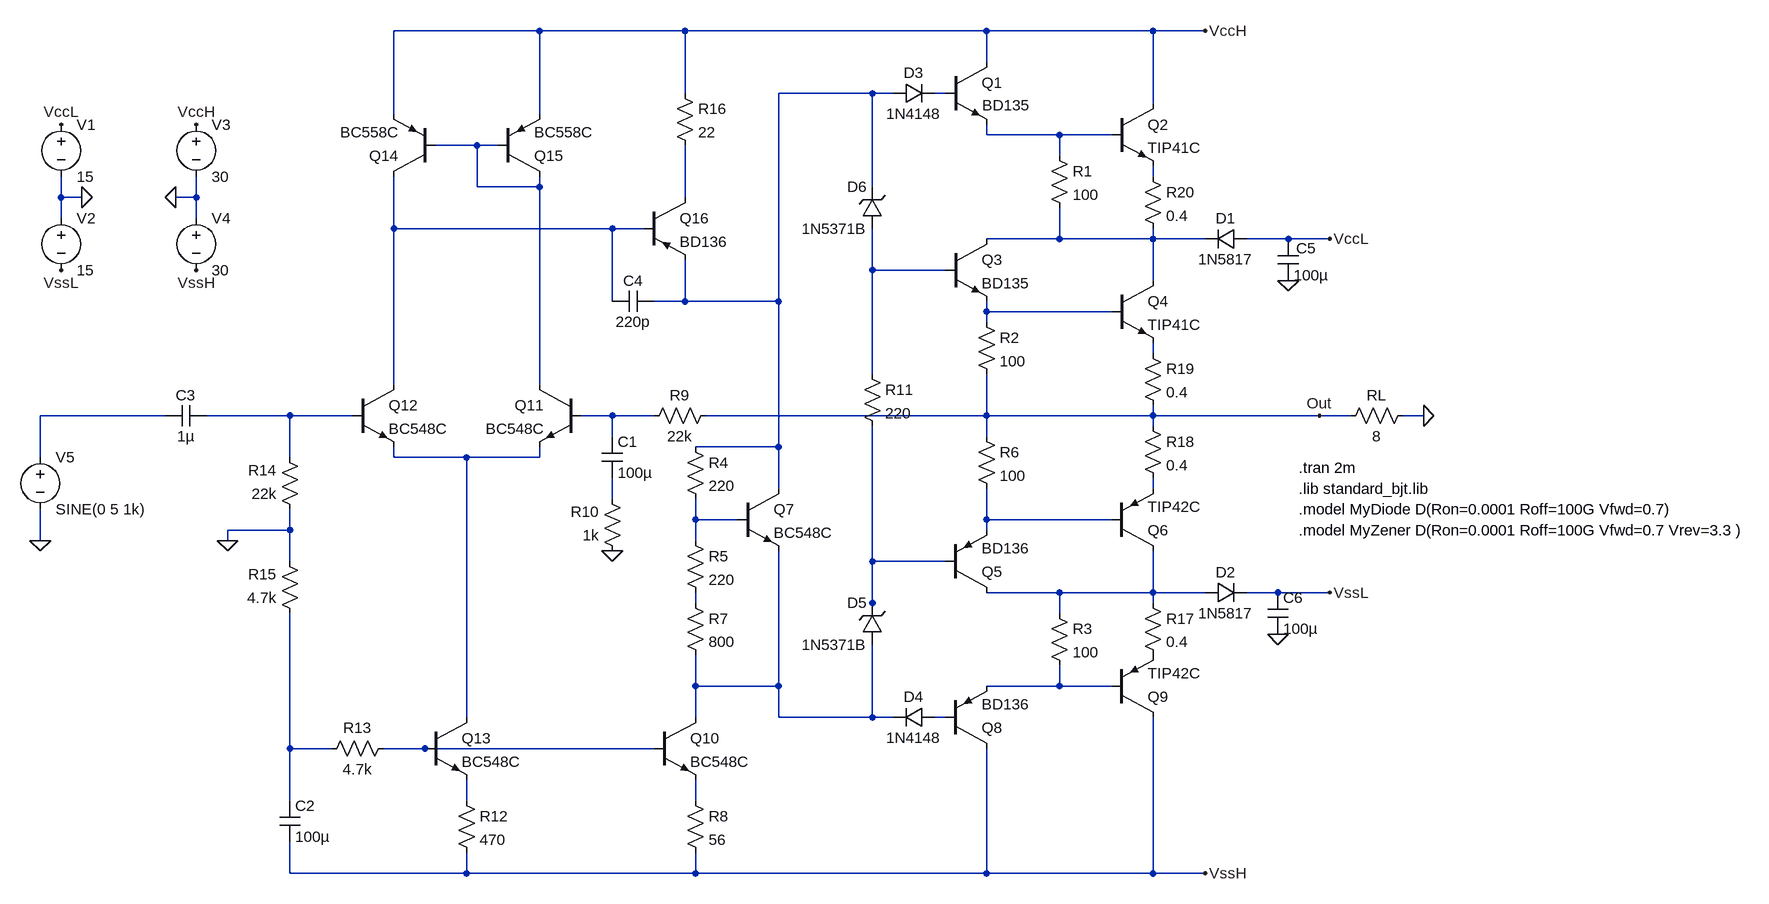
[diagram p0: schematic etapa_clase_G.asc]
etapa_clase_G.asc, the LTspice schematic file:
Version 4
SHEET 1 1736 1404
WIRE -512 48 -736 48
WIRE -288 48 -512 48
WIRE 176 48 -288 48
WIRE 432 48 176 48
WIRE 512 48 432 48
WIRE 176 96 176 48
WIRE -288 144 -288 48
WIRE 0 144 -144 144
WIRE 32 144 0 144
WIRE 112 144 96 144
WIRE 432 160 432 48
WIRE -736 176 -736 48
WIRE -512 176 -512 48
WIRE 176 208 176 192
WIRE 288 208 176 208
WIRE 368 208 288 208
WIRE -608 224 -672 224
WIRE -576 224 -608 224
WIRE 288 240 288 208
WIRE 432 272 432 256
WIRE -608 288 -608 224
WIRE -512 288 -512 272
WIRE -512 288 -608 288
WIRE 0 288 0 144
WIRE -1248 304 -1248 272
WIRE -1216 304 -1248 304
WIRE -1040 304 -1040 272
WIRE -1040 304 -1072 304
WIRE -288 304 -288 224
WIRE -1248 336 -1248 304
WIRE -1040 336 -1040 304
WIRE -736 352 -736 272
WIRE -400 352 -736 352
WIRE -352 352 -400 352
WIRE 288 368 288 320
WIRE 288 368 176 368
WIRE 432 368 432 352
WIRE 432 368 288 368
WIRE 512 368 432 368
WIRE 640 368 576 368
WIRE 704 368 640 368
WIRE 0 416 0 352
WIRE 112 416 0 416
WIRE 432 432 432 368
WIRE -400 464 -400 352
WIRE -288 464 -288 400
WIRE -288 464 -336 464
WIRE -144 464 -144 144
WIRE -144 464 -288 464
WIRE 176 480 176 464
WIRE 368 480 176 480
WIRE 176 496 176 480
WIRE 432 544 432 528
WIRE 0 576 0 416
WIRE -736 592 -736 352
WIRE -512 592 -512 288
WIRE -1088 640 -1280 640
WIRE -896 640 -1024 640
WIRE -800 640 -896 640
WIRE -400 640 -448 640
WIRE -336 640 -400 640
WIRE 176 640 176 576
WIRE 176 640 -256 640
WIRE 432 640 432 624
WIRE 432 640 176 640
WIRE 688 640 432 640
WIRE 736 640 688 640
WIRE 848 640 816 640
WIRE 432 656 432 640
WIRE -400 672 -400 640
WIRE 176 672 176 640
WIRE -144 688 -144 464
WIRE -144 688 -272 688
WIRE -1280 704 -1280 640
WIRE -896 704 -896 640
WIRE -736 704 -736 688
WIRE -624 704 -736 704
WIRE -512 704 -512 688
WIRE -512 704 -624 704
WIRE -144 752 -144 688
WIRE 432 752 432 736
WIRE -400 768 -400 736
WIRE -272 800 -272 768
WIRE -208 800 -272 800
WIRE 176 800 176 752
WIRE 368 800 176 800
WIRE -896 816 -896 784
WIRE -896 816 -992 816
WIRE 176 816 176 800
WIRE -1280 832 -1280 784
WIRE -992 832 -992 816
WIRE -272 832 -272 800
WIRE -896 864 -896 816
WIRE 0 864 0 656
WIRE 112 864 0 864
WIRE 288 912 176 912
WIRE 432 912 432 848
WIRE 432 912 288 912
WIRE 512 912 432 912
WIRE 624 912 576 912
WIRE 704 912 624 912
WIRE -272 928 -272 912
WIRE 0 928 0 864
WIRE 432 928 432 912
WIRE 0 944 0 928
WIRE 288 944 288 912
WIRE -272 1056 -272 1008
WIRE -144 1056 -144 848
WIRE -144 1056 -272 1056
WIRE 288 1056 288 1024
WIRE 288 1056 176 1056
WIRE 368 1056 288 1056
WIRE -624 1104 -624 704
WIRE -272 1104 -272 1056
WIRE -144 1104 -144 1056
WIRE 0 1104 0 992
WIRE 0 1104 -144 1104
WIRE 32 1104 0 1104
WIRE 112 1104 96 1104
WIRE -896 1152 -896 944
WIRE -832 1152 -896 1152
WIRE -688 1152 -752 1152
WIRE -336 1152 -688 1152
WIRE -896 1232 -896 1152
WIRE -624 1232 -624 1200
WIRE -272 1232 -272 1200
WIRE -896 1344 -896 1296
WIRE -624 1344 -624 1312
WIRE -624 1344 -896 1344
WIRE -272 1344 -272 1312
WIRE -272 1344 -624 1344
WIRE 176 1344 176 1152
WIRE 176 1344 -272 1344
WIRE 432 1344 432 1104
WIRE 432 1344 176 1344
WIRE 512 1344 432 1344
FLAG 704 368 VccL
FLAG 512 48 VccH
FLAG 848 640 0
FLAG 512 1344 VssH
FLAG 704 912 VssL
FLAG -1216 304 0
FLAG -1072 304 0
FLAG -1040 192 VccH
FLAG -1248 192 VccL
FLAG -1040 416 VssH
FLAG -1248 416 VssL
FLAG 688 640 Out
FLAG -400 848 0
FLAG -992 832 0
FLAG -1280 832 0
FLAG 640 432 0
FLAG 624 976 0
SYMBOL npn 112 96 R0
WINDOW 3 57 66 Left 2
SYMATTR Value BD135
SYMATTR InstName Q1
SYMBOL npn 368 160 R0
SYMATTR InstName Q2
SYMATTR Value TIP41C
SYMBOL npn 112 368 R0
SYMATTR InstName Q3
SYMATTR Value BD135
SYMBOL npn 368 432 R0
SYMATTR InstName Q4
SYMATTR Value TIP41C
SYMBOL res 272 224 R0
SYMATTR InstName R1
SYMATTR Value 100
SYMBOL res 720 656 R270
WINDOW 0 32 56 VTop 2
WINDOW 3 0 56 VBottom 2
SYMATTR InstName RL
SYMATTR Value 8
SYMBOL pnp 112 912 M180
SYMATTR InstName Q5
SYMATTR Value BD136
SYMBOL pnp 368 848 M180
SYMATTR InstName Q6
SYMATTR Value TIP42C
SYMBOL diode 512 928 R270
WINDOW 0 32 32 VTop 2
WINDOW 3 0 32 VBottom 2
SYMATTR InstName D2
SYMATTR Value 1N5817
SYMBOL pnp 368 1104 M180
SYMATTR InstName Q9
SYMATTR Value TIP42C
SYMBOL pnp 112 1152 M180
SYMATTR InstName Q8
SYMATTR Value BD136
SYMBOL res 272 928 R0
SYMATTR InstName R3
SYMATTR Value 100
SYMBOL voltage -1248 176 R0
WINDOW 123 0 0 Left 0
WINDOW 39 0 0 Left 0
SYMATTR InstName V1
SYMATTR Value 15
SYMBOL voltage -1248 320 R0
WINDOW 123 0 0 Left 0
WINDOW 39 0 0 Left 0
SYMATTR InstName V2
SYMATTR Value 15
SYMBOL voltage -1040 176 R0
WINDOW 123 0 0 Left 0
WINDOW 39 0 0 Left 0
SYMATTR InstName V3
SYMATTR Value 30
SYMBOL voltage -1040 320 R0
WINDOW 123 0 0 Left 0
WINDOW 39 0 0 Left 0
SYMATTR InstName V4
SYMATTR Value 30
SYMBOL diode 32 160 R270
WINDOW 0 32 32 VTop 2
WINDOW 3 0 32 VBottom 2
SYMATTR InstName D3
SYMATTR Value 1N4148
SYMBOL diode 96 1088 R90
WINDOW 0 0 32 VBottom 2
WINDOW 3 32 32 VTop 2
SYMATTR InstName D4
SYMATTR Value 1N4148
SYMBOL res 160 480 R0
SYMATTR InstName R2
SYMATTR Value 100
SYMBOL res 160 656 R0
SYMATTR InstName R6
SYMATTR Value 100
SYMBOL zener 16 992 R180
WINDOW 0 24 64 Left 2
WINDOW 3 24 0 Left 2
SYMATTR InstName D5
SYMATTR Value 1N5371B
SYMBOL zener 16 352 R180
WINDOW 0 24 64 Left 2
WINDOW 3 24 0 Left 2
SYMATTR InstName D6
SYMATTR Value 1N5371B
SYMBOL npn -208 752 R0
SYMATTR InstName Q7
SYMATTR Value BC548C
SYMBOL res -288 672 R0
SYMATTR InstName R4
SYMATTR Value 220
SYMBOL res -288 816 R0
SYMATTR InstName R5
SYMATTR Value 220
SYMBOL res -288 912 R0
SYMATTR InstName R7
SYMATTR Value 800
SYMBOL npn -336 1104 R0
SYMATTR InstName Q10
SYMATTR Value BC548C
SYMBOL res -288 1216 R0
SYMATTR InstName R8
SYMATTR Value 56
SYMBOL npn -448 592 M0
SYMATTR InstName Q11
SYMATTR Value BC548C
SYMBOL res -240 624 R90
WINDOW 0 0 56 VBottom 2
WINDOW 3 32 56 VTop 2
SYMATTR InstName R9
SYMATTR Value 22k
SYMBOL res -384 864 R180
WINDOW 0 36 76 Left 2
WINDOW 3 36 40 Left 2
SYMATTR InstName R10
SYMATTR Value 1k
SYMBOL cap -416 672 R0
SYMATTR InstName C1
SYMATTR Value 100µ
SYMBOL res -16 560 R0
SYMATTR InstName R11
SYMATTR Value 220
SYMBOL npn -800 592 R0
SYMATTR InstName Q12
SYMATTR Value BC548C
SYMBOL npn -688 1104 R0
SYMATTR InstName Q13
SYMATTR Value BC548C
SYMBOL res -640 1216 R0
SYMATTR InstName R12
SYMATTR Value 470
SYMBOL res -736 1136 R90
WINDOW 0 0 56 VBottom 2
WINDOW 3 32 56 VTop 2
SYMATTR InstName R13
SYMATTR Value 4.7k
SYMBOL res -880 800 R180
WINDOW 0 36 76 Left 2
WINDOW 3 36 40 Left 2
SYMATTR InstName R14
SYMATTR Value 22k
SYMBOL res -880 960 R180
WINDOW 0 36 76 Left 2
WINDOW 3 36 40 Left 2
SYMATTR InstName R15
SYMATTR Value 4.7k
SYMBOL cap -912 1232 R0
SYMATTR InstName C2
SYMATTR Value 100µ
SYMBOL cap -1024 624 R90
WINDOW 0 0 32 VBottom 2
WINDOW 3 32 32 VTop 2
SYMATTR InstName C3
SYMATTR Value 1µ
SYMBOL voltage -1280 688 R0
WINDOW 123 24 124 Left 2
WINDOW 39 0 0 Left 0
SYMATTR InstName V5
SYMATTR Value SINE(0 5 1k)
SYMBOL pnp -672 272 R180
SYMATTR InstName Q14
SYMATTR Value BC558C
SYMBOL pnp -576 272 M180
SYMATTR InstName Q15
SYMATTR Value BC558C
SYMBOL res -304 128 R0
SYMATTR InstName R16
SYMATTR Value 22
SYMBOL pnp -352 304 R0
SYMATTR InstName Q16
SYMATTR Value BD136
SYMBOL cap -336 448 R90
WINDOW 0 0 32 VBottom 2
WINDOW 3 32 32 VTop 2
SYMATTR InstName C4
SYMATTR Value 220p
SYMBOL res 416 912 R0
SYMATTR InstName R17
SYMATTR Value 0.4
SYMBOL res 416 640 R0
SYMATTR InstName R18
SYMATTR Value 0.4
SYMBOL res 416 528 R0
SYMATTR InstName R19
SYMATTR Value 0.4
SYMBOL res 416 256 R0
SYMATTR InstName R20
SYMATTR Value 0.4
SYMBOL cap 624 368 R0
WINDOW 0 28 14 Left 2
SYMATTR InstName C5
SYMATTR Value 100µ
SYMBOL cap 608 912 R0
SYMATTR InstName C6
SYMATTR Value 100µ
SYMBOL diode 576 352 R90
WINDOW 0 0 32 VBottom 2
WINDOW 3 32 32 VTop 2
SYMATTR InstName D1
SYMATTR Value 1N5817
TEXT 656 784 Left 2 !.model MyDiode D(Ron=0.0001 Roff=100G Vfwd=0.7)
TEXT 656 752 Left 2 !.lib standard_bjt.lib
TEXT 656 720 Left 2 !.tran 2m
TEXT 656 816 Left 2 !.model MyZener D(Ron=0.0001 Roff=100G Vfwd=0.7 Vrev=3.3 )

The netlist it stands for:
* etapa_clase_G.asc
Q1 VccH N002 N003 0 BD135
Q2 VccH N003 N005 0 TIP41C
Q3 N008 N009 N010 0 BD135
Q4 N008 N010 N011 0 TIP41C
R1 N003 N008 100
RL Out 0 8
Q5 N021 N020 N019 0 BD136
Q6 N021 N019 N016 0 TIP42C
D2 N021 VssL 1N5817
Q9 VssH N024 P001 0 TIP42C
Q8 VssH N025 N024 0 BD136
R3 N021 N024 100
V1 VccL 0 15
V2 0 VssL 15
V3 VccH 0 30
V4 0 VssH 30
D3 N001 N002 1N4148
D4 N025 N023 1N4148
R2 N010 Out 100
R6 Out N019 100
D5 N023 N020 1N5371B
D6 N009 N001 1N5371B
Q7 N001 N018 N023 0 BC548C
R4 N001 N018 220
R5 N018 N022 220
R7 N022 N023 800
Q10 N023 N027 N029 0 BC548C
R8 N029 VssH 56
Q11 N004 N014 N015 0 BC548C
R9 Out N014 22k
R10 0 N017 1k
C1 N014 N017 100µ
R11 N009 N020 220
Q12 N007 N013 N015 0 BC548C
Q13 N015 N027 N028 0 BC548C
R12 N028 VssH 470
R13 N027 N026 4.7k
R14 0 N013 22k
R15 N026 0 4.7k
C2 N026 VssH 100µ
C3 N013 N012 1µ
V5 N012 0 SINE(0 5 1k)
Q14 N007 N004 VccH 0 BC558C
Q15 N004 N004 VccH 0 BC558C
R16 VccH N006 22
Q16 N006 N007 N001 0 BD136
C4 N001 N007 220p
R17 N021 P001 0.4
R18 Out N016 0.4
R19 N011 Out 0.4
R20 N005 N008 0.4
C5 VccL 0 100µ
C6 VssL 0 100µ
D1 VccL N008 1N5817
.model D D
.lib standard.dio
.model NPN NPN
.model PNP PNP
.lib standard.bjt
.model MyDiode D(Ron=0.0001 Roff=100G Vfwd=0.7)
.lib standard_bjt.lib
.tran 2m
.model MyZener D(Ron=0.0001 Roff=100G Vfwd=0.7 Vrev=3.3 )
.backanno
.end